# EAGLE design Projeto Lora (EAGLE 9.6.2)
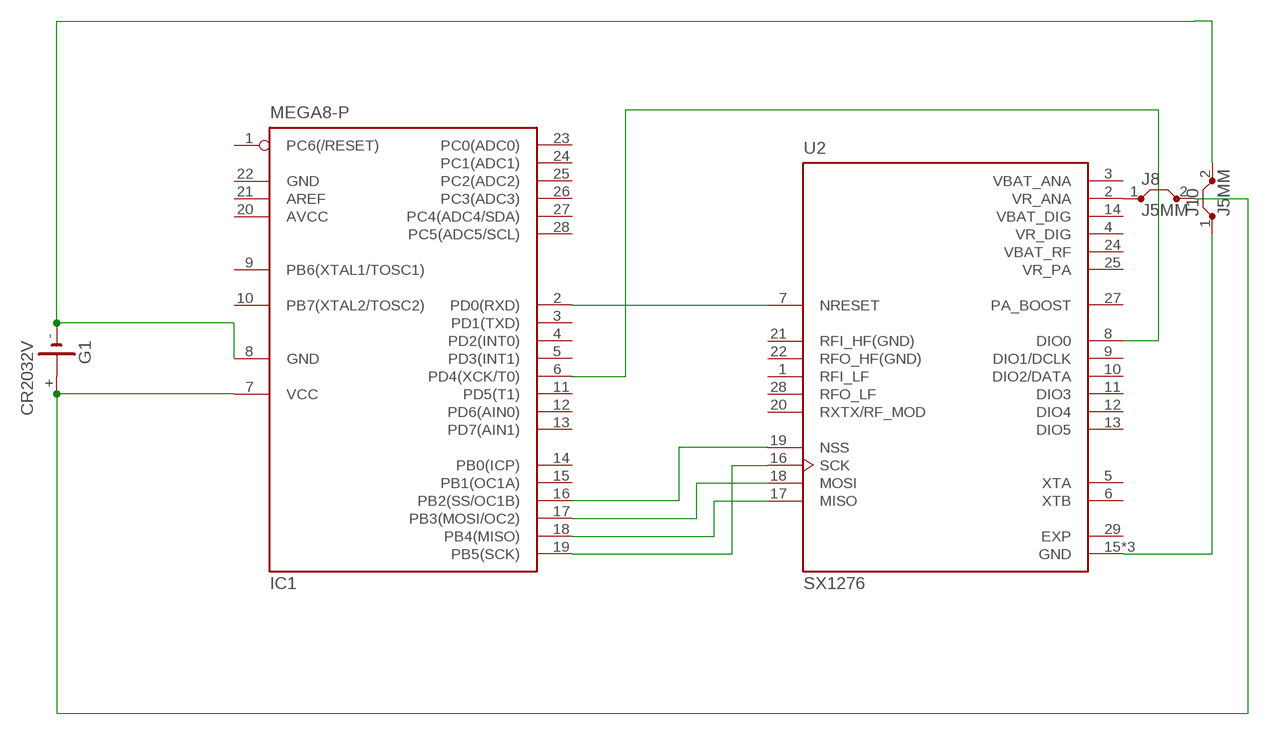
[diagram p0: schematic, sheet 1]

## Parts
G1  CR2032V  [CR2032V]
IC1  MEGA8-P  [DIL28-3]
J8  J5MM  [05]
J10  J5MM  [05]
U2  SX1276  [QFN65P600X600X100-29N]

## Nets
N$1: IC1.18(PB4(MISO)) U2.17(MISO)
N$2: IC1.17(PB3(MOSI/OC2)) U2.18(MOSI)
N$3: IC1.16(PB2(SS/OC1B)) U2.19(NSS)
N$5: IC1.19(PB5(SCK)) U2.16(SCK)
N$7: G1.- IC1.8(GND) J10.2
N$8: G1.+ IC1.7(VCC) J8.2
N$11: IC1.2(PD0(RXD)) U2.7(NRESET)
N$13: J8.1 U2.2(VR_ANA)
N$15: J10.1 U2.15(GND) U2.23(GND) U2.26(GND)
N$16: IC1.6(PD4(XCK/T0)) U2.8(DIO0)
Unconnected: G1.+@1(+) IC1.1(PC6(/RESET)) IC1.3(PD1(TXD)) IC1.4(PD2(INT0)) IC1.5(PD3(INT1)) IC1.9(PB6(XTAL1/TOSC1)) IC1.10(PB7(XTAL2/TOSC2)) IC1.11(PD5(T1)) IC1.12(PD6(AIN0)) IC1.13(PD7(AIN1)) IC1.14(PB0(ICP)) IC1.15(PB1(OC1A)) IC1.21(AREF) IC1.23(PC0(ADC0)) IC1.24(PC1(ADC1)) IC1.25(PC2(ADC2)) IC1.26(PC3(ADC3)) IC1.27(PC4(ADC4/SDA)) IC1.28(PC5(ADC5/SCL)) U2.1(RFI_LF) U2.5(XTA) U2.6(XTB) U2.9(DIO1/DCLK) U2.10(DIO2/DATA) U2.11(DIO3) U2.12(DIO4) U2.13(DIO5) U2.20(RXTX/RF_MOD) U2.21(RFI_HF(GND)) U2.22(RFO_HF(GND)) U2.27(PA_BOOST) U2.28(RFO_LF)

## Power pins joined to a net without a drawn wire
AVCC: IC1.20(AVCC)
EXP: U2.29(EXP)
GND: IC1.22(GND)
VBAT_ANA: U2.3(VBAT_ANA)
VBAT_DIG: U2.14(VBAT_DIG)
VBAT_RF: U2.24(VBAT_RF)
VR_DIG: U2.4(VR_DIG)
VR_PA: U2.25(VR_PA)

## Library data of the parts
G1 = battery:CR2032V: LI BATTERY Varta
IC1 = atmel:MEGA8-P: MICROCONTROLLER 8 Kbytes FLASH, 1 kbytes SRAM, 512 bytes EEPROM, USART, 4-channel 10 bit ADC, 2-channel 8 bit ADC Pin compatible with Atmega48, ATMega88, ATMega168 Source: avr.lbr; OC_FARNELL: unknown; OC_NEWARK: unknown
J8 J10 = jumper:J: Bridge
U2 = SX1276:SX1276: RF Transceiver FSK/GFSK/MSK/GMSK/LoRa/OOK 137MHz to 1020MHz 28-Pin QFN Check prices <https://pricing.snapeda.com/parts/SX1276/Semtech%20Corporation/view-part?ref=eda>; AVAILABILITY: In Stock; DESCRIPTION: IC RF TxRx Only 802.15.4 LoRa™ 137MHz ~ 1.02GHz 28-VQFN Exposed Pad; MF: Semtech Corporation; MP: SX1276; PACKAGE: VQFN-28 Semtech Corporation; PRICE: None; PURCHASE-URL: https://pricing.snapeda.com/search/part/SX1276/?ref=eda

## Board
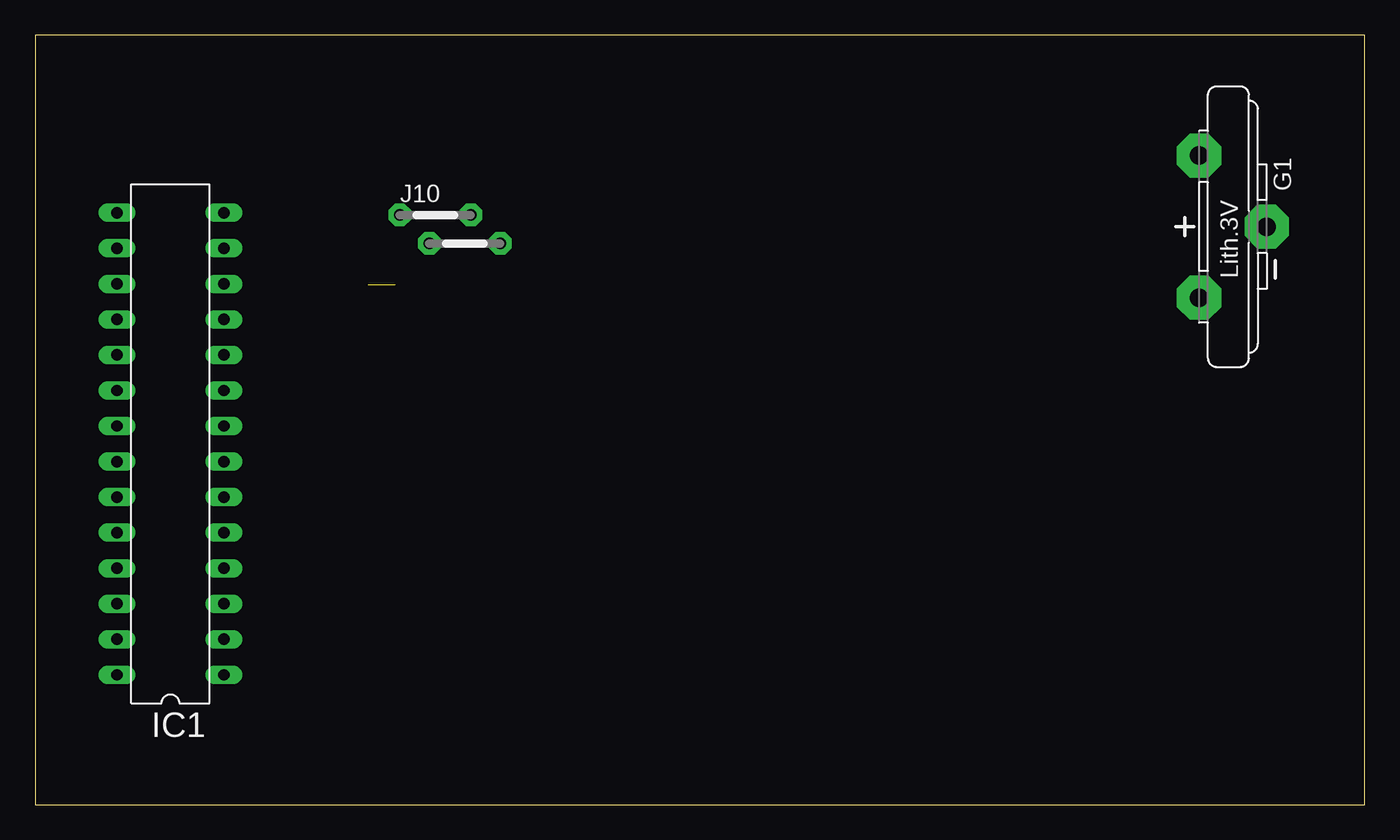
[diagram p1: board, top side]
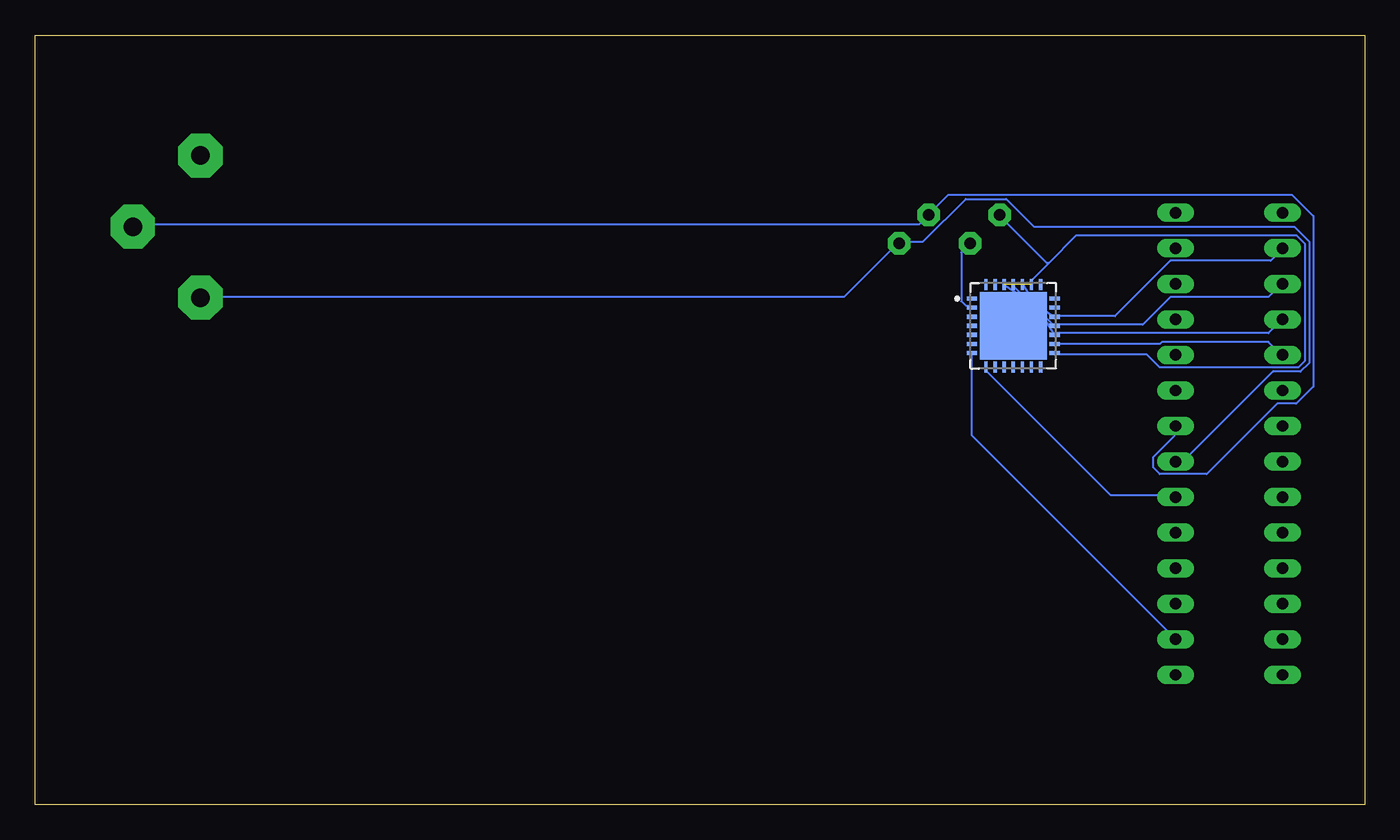
[diagram p2: board, bottom side, seen from below]

Size 95 x 55 mm. Coordinates in mm from the lower left corner, seen from the top.
Outline: 0,0 95,0 95,55 0,55 0,0
Copper layers (1*16): Top 0.035mm / dielectric 1.5mm / Bottom 0.035mm
Design rules "default": minimum track width 6mil, minimum drill 0.35mm, track to track 6mil, track to pad 6mil, pad to pad 6mil, via to via 6mil, smd to smd 6mil, copper to edge 40mil, drill to drill 6mil, minimum pad ring 10mil, minimum via ring 8mil, stop-mask expansion 4mil, vias tented up to drill 0mil, thermal gap 10mil

### Footprints (pad centres in the part's own frame; a part is rotated, then mirrored left to right if it is on the bottom)
CR2032V = drill 1.321 pad 3.15 octagon: + -2.54,-5.08; +@1 -2.54,5.08; - 2.286,0
DIL28-3 = drill 0.813 long: 1 -16.51,-3.81; 2 -13.97,-3.81; 3 -11.43,-3.81; 4 -8.89,-3.81; 5 -6.35,-3.81; 6 -3.81,-3.81; 7 -1.27,-3.81; 8 1.27,-3.81; 9 3.81,-3.81; 10 6.35,-3.81; 11 8.89,-3.81; 12 11.43,-3.81; 13 13.97,-3.81; 14 16.51,-3.81; 15 16.51,3.81; 16 13.97,3.81; 17 11.43,3.81; 18 8.89,3.81; 19 6.35,3.81; 20 3.81,3.81; 21 1.27,3.81; 22 -1.27,3.81; 23 -3.81,3.81; 24 -6.35,3.81; 25 -8.89,3.81; 26 -11.43,3.81; 27 -13.97,3.81; 28 -16.51,3.81
05 = drill 0.813 pad 1.6 octagon: 1 -2.54,0; 2 2.54,0
QFN65P600X600X100-29N = smd 0.81 x 0.32: 1 -2.955,1.95; 2 -2.955,1.3; 3 -2.955,0.65; 4 -2.955,0; 5 -2.955,-0.65; 6 -2.955,-1.3; 7 -2.955,-1.95; 15 2.955,-1.95; 16 2.955,-1.3; 17 2.955,-0.65; 18 2.955,0; 19 2.955,0.65; 20 2.955,1.3; 21 2.955,1.95 | smd 0.32 x 0.81: 8 -1.95,-2.955; 9 -1.3,-2.955; 10 -0.65,-2.955; 11 0,-2.955; 12 0.65,-2.955; 13 1.3,-2.955; 14 1.95,-2.955; 22 1.95,2.955; 23 1.3,2.955; 24 0.65,2.955; 25 0,2.955; 26 -0.65,2.955; 27 -1.3,2.955; 28 -1.95,2.955 | smd 4.8 x 4.8: 29 0,0

### Placement (x,y rotation side)
G1  85.72,41.3 0 top
IC1  9.68,25.78 90 top
J8  30.71,40.11 0 top
J10  28.6,42.14 0 top
U2  25.1,34.21 0 bottom

### Tracks (layer width: path | path; a pad name or v marks a point on that pad's centre or on a via)
N$1
  Bottom 0.152: 24.46,37.21 U2.17 22.1,33.68 6.86,33.68 IC1.18
N$2
  Bottom 0.152: 25.22,37.21 U2.18 22.1,34.29 15.85,34.29 13.87,36.27 6.86,36.27 5.94,37.19 IC1.17
N$3
  Bottom 0.152: 25.83,37.21 U2.19 22.1,34.9 17.83,34.9 13.87,38.86 6.71,38.86 5.94,39.62 IC1.16
N$5
  Bottom 0.152: U2.16 22.1,32.92 14.63,32.92 14.48,33.07 6.86,33.07 5.94,32.16 IC1.19
N$7
  Bottom 0.152: 31.04,42.09 J10.2 | 87.88,41.4 G1.- 87.94,41.45 31.85,41.45 31.24,42.06 J10.2 | 31.19,42.24 J10.2 | IC1.8 13.56,26.98 13.56,26.36 15.09,24.84 15.09,24.08 14.63,23.62 11.28,23.62 6.25,28.65 4.88,28.65 3.66,29.87 3.66,42.06 5.18,43.59 29.72,43.59 31.09,42.22 J10.2
N$8
  Bottom 0.152: 33.15,40.06 J8.2 | IC1.7 13.41,24.54 12.95,24.54 6.55,30.94 4.57,30.94 3.96,31.55 3.96,40.23 5.03,41.3 23.62,41.3 25.6,43.28 28.5,43.28 31.55,40.23 33.22,40.23 J8.2 | G1.+ 83.06,36.27 37.19,36.27 33.38,40.08 J8.2
N$11
  Bottom 0.152: IC1.2 28.04,26.36 28.04,32.16 U2.7
N$13
  Bottom 0.152: J8.1 28.8,39.47 28.8,35.97 28.5,35.66 28.19,35.66 U2.2
N$15  (1 unrouted)
  Bottom 0.152: 26.01,42.09 J10.1 26.06,42.06 22.71,38.71 22.55,38.71 | 22.55,38.71 23.77,37.49 23.77,37.19 U2.23 | 22.55,38.71 20.57,40.69 4.88,40.69 4.27,40.08 4.27,31.7 4.72,31.24 14.63,31.24 15.54,32.16 22.1,32.16 U2.15
N$16
  Bottom 0.152: U2.8 26.98,31.24 26.98,30.94 18.14,22.1 13.56,22.1 IC1.6